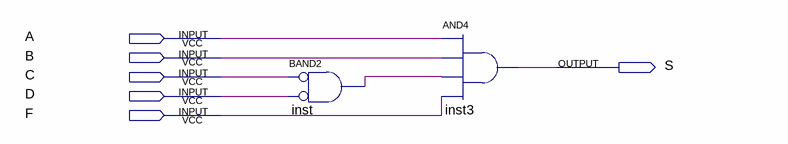
[diagram p0: schematic sheet]
// Quartus schematic Block10.bdf as structural Verilog: 2 symbols, 6 pins
module Block10 (
  input  A,
  input  B,
  input  C,
  input  D,
  input  F,
  output S
);

  wire inst_out;

  and inst (inst_out, ~C, ~D);  // BAND2
  and inst3 (S, A, B, inst_out, F);
endmodule
